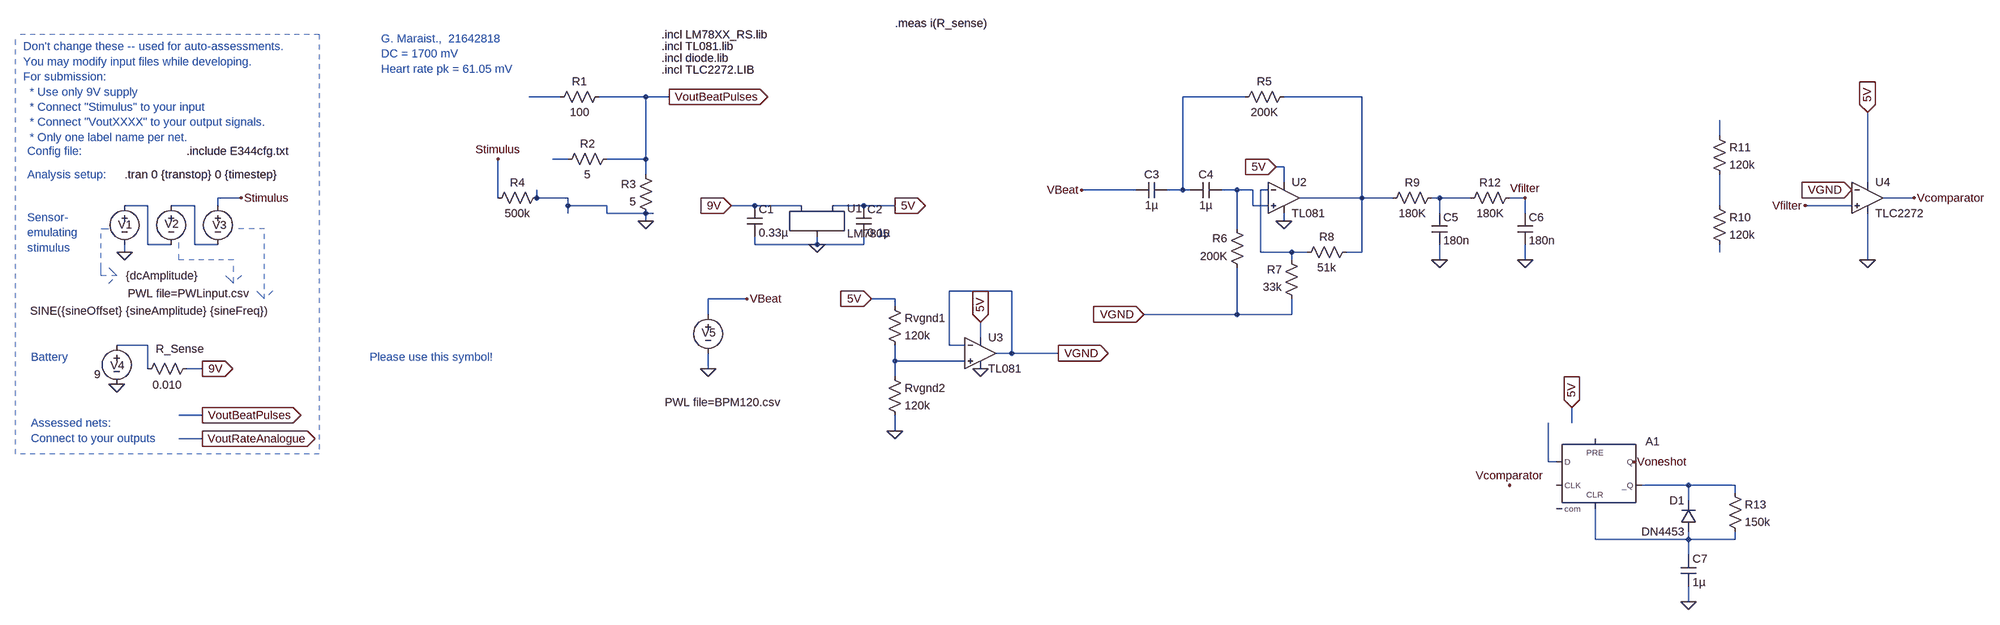
[diagram p0: schematic E344_Ass2_template.asc]
E344_Ass2_template.asc, the LTspice schematic file:
Version 4
SHEET 1 1824 680
WIRE -1184 -1280 -1248 -1280
WIRE -1008 -1280 -1104 -1280
WIRE -960 -1280 -1008 -1280
WIRE 224 -1280 96 -1280
WIRE 464 -1280 304 -1280
WIRE 1200 -1200 1200 -1232
WIRE -1168 -1152 -1200 -1152
WIRE -1008 -1152 -1008 -1280
WIRE -1008 -1152 -1088 -1152
WIRE 304 -1136 288 -1136
WIRE -1008 -1120 -1008 -1152
WIRE 304 -1104 304 -1136
WIRE 1504 -1104 1504 -1248
WIRE 0 -1088 -112 -1088
WIRE 96 -1088 96 -1280
WIRE 96 -1088 64 -1088
WIRE 112 -1088 96 -1088
WIRE 208 -1088 176 -1088
WIRE 240 -1088 208 -1088
WIRE 272 -1088 256 -1088
WIRE -1840 -1072 -1888 -1072
WIRE -1312 -1072 -1312 -1152
WIRE -1232 -1072 -1232 -1088
WIRE -1168 -1072 -1232 -1072
WIRE 464 -1072 464 -1280
WIRE 464 -1072 336 -1072
WIRE 528 -1072 464 -1072
WIRE 624 -1072 608 -1072
WIRE 688 -1072 624 -1072
WIRE 800 -1072 768 -1072
WIRE 1600 -1072 1536 -1072
WIRE -2032 -1056 -2080 -1056
WIRE -1936 -1056 -1984 -1056
WIRE -1888 -1056 -1888 -1072
WIRE -1168 -1056 -1168 -1072
WIRE -1088 -1056 -1168 -1056
WIRE -784 -1056 -832 -1056
WIRE -688 -1056 -784 -1056
WIRE -560 -1056 -624 -1056
WIRE -496 -1056 -560 -1056
WIRE 240 -1056 240 -1088
WIRE 272 -1056 240 -1056
WIRE 1200 -1056 1200 -1120
WIRE 1472 -1056 1376 -1056
WIRE -1168 -1040 -1168 -1056
WIRE -1088 -1040 -1088 -1056
WIRE -1008 -1040 -1088 -1040
WIRE -992 -1040 -1008 -1040
WIRE 624 -1040 624 -1072
WIRE 800 -1040 800 -1072
WIRE -1008 -1024 -1008 -1040
WIRE 304 -1024 304 -1040
WIRE 208 -1008 208 -1088
WIRE -2032 -976 -2032 -1056
WIRE -1984 -976 -2032 -976
WIRE -1936 -976 -1936 -1056
WIRE -1888 -976 -1936 -976
WIRE -784 -976 -784 -992
WIRE -656 -976 -656 -992
WIRE -656 -976 -784 -976
WIRE -560 -976 -560 -992
WIRE -560 -976 -656 -976
WIRE -2080 -960 -2080 -976
WIRE 256 -960 256 -1088
WIRE 320 -960 256 -960
WIRE 352 -960 320 -960
WIRE 464 -960 464 -1072
WIRE 464 -960 432 -960
WIRE 1200 -960 1200 -976
WIRE 320 -944 320 -960
WIRE 624 -944 624 -976
WIRE 800 -944 800 -976
WIRE 1504 -944 1504 -1040
WIRE -256 -880 -384 -880
WIRE -800 -864 -880 -864
WIRE -496 -864 -544 -864
WIRE -496 -848 -496 -864
WIRE -880 -832 -880 -864
WIRE 208 -832 208 -928
WIRE 208 -832 16 -832
WIRE 320 -832 320 -864
WIRE 320 -832 208 -832
WIRE -320 -784 -320 -816
WIRE -2032 -768 -2096 -768
WIRE -384 -768 -384 -880
WIRE -352 -768 -384 -768
WIRE -256 -752 -256 -880
WIRE -256 -752 -288 -752
WIRE -160 -752 -256 -752
WIRE -496 -736 -496 -768
WIRE -352 -736 -496 -736
WIRE -2032 -720 -2032 -768
WIRE -1920 -720 -1952 -720
WIRE -880 -720 -880 -752
WIRE -496 -704 -496 -736
WIRE -1920 -624 -1968 -624
WIRE 896 -608 896 -640
WIRE -496 -592 -496 -624
WIRE -1920 -576 -1968 -576
WIRE 848 -528 848 -608
WIRE 864 -528 848 -528
WIRE 1136 -480 1040 -480
WIRE 1232 -480 1136 -480
WIRE 1232 -464 1232 -480
WIRE 1136 -448 1136 -480
WIRE 944 -368 944 -432
WIRE 1136 -368 1136 -384
WIRE 1136 -368 944 -368
WIRE 1232 -368 1232 -384
WIRE 1232 -368 1136 -368
WIRE 1136 -336 1136 -368
WIRE 1136 -240 1136 -272
FLAG -2080 -960 0
FLAG -1840 -1072 Stimulus
FLAG -1920 -720 9V
IOPIN -1920 -720 Out
FLAG -2096 -688 0
FLAG -832 -1056 9V
IOPIN -832 -1056 In
FLAG -1920 -624 VoutBeatPulses
IOPIN -1920 -624 Out
FLAG -1312 -1152 Stimulus
FLAG -1008 -1024 0
FLAG -1920 -576 VoutRateAnalogue
IOPIN -1920 -576 Out
FLAG -960 -1280 VoutBeatPulses
IOPIN -960 -1280 Out
FLAG -656 -976 0
FLAG -496 -1056 5V
IOPIN -496 -1056 Out
FLAG -880 -720 0
FLAG -800 -864 VBeat
FLAG -160 -752 VGND
IOPIN -160 -752 Out
FLAG -496 -592 0
FLAG -544 -864 5V
IOPIN -544 -864 In
FLAG 304 -1024 0
FLAG 288 -1136 5V
IOPIN 288 -1136 In
FLAG 16 -832 VGND
IOPIN 16 -832 In
FLAG -112 -1088 VBeat
FLAG -320 -720 0
FLAG -320 -816 5V
IOPIN -320 -816 In
FLAG 624 -944 0
FLAG 1504 -1248 5V
IOPIN 1504 -1248 In
FLAG 1504 -944 0
FLAG 1600 -1072 Vcomparator
FLAG 1376 -1056 Vfilter
FLAG 800 -944 0
FLAG 800 -1072 Vfilter
FLAG 1136 -240 0
FLAG 1024 -528 Voneshot
FLAG 896 -640 5V
IOPIN 896 -640 In
FLAG 768 -480 Vcomparator
FLAG 1472 -1088 VGND
IOPIN 1472 -1088 In
SYMBOL voltage -1984 -1072 R0
WINDOW 123 0 0 Left 0
WINDOW 39 0 0 Left 0
WINDOW 3 -89 197 Left 2
WINDOW 0 -13 54 Left 2
SYMATTR Value PWL file=PWLinput.csv
SYMATTR InstName V2
SYMBOL voltage -1888 -1072 R0
WINDOW 123 24 44 Left 2
WINDOW 39 0 0 Left 0
WINDOW 3 -386 233 Left 2
WINDOW 0 -11 56 Left 2
SYMATTR Value SINE({sineOffset} {sineAmplitude} {sineFreq})
SYMATTR InstName V3
SYMBOL voltage -2080 -1072 R0
WINDOW 123 0 0 Left 0
WINDOW 39 0 0 Left 0
WINDOW 3 3 160 Left 2
WINDOW 0 -13 55 Left 2
SYMATTR Value {dcAmplitude}
SYMATTR InstName V1
SYMBOL voltage -2096 -784 R0
WINDOW 123 24 44 Left 2
WINDOW 39 0 0 Left 0
WINDOW 3 -46 76 Left 2
WINDOW 0 -13 57 Left 2
SYMATTR Value 9
SYMATTR InstName V4
SYMBOL res -1936 -736 R90
WINDOW 0 -9 30 VBottom 2
WINDOW 3 34 56 VTop 2
SYMATTR InstName R_Sense
SYMATTR Value 0.010
SYMBOL res -1200 -1264 R270
WINDOW 0 32 56 VTop 2
WINDOW 3 0 56 VBottom 2
SYMATTR InstName R1
SYMATTR Value 100
SYMBOL res -1072 -1168 R90
WINDOW 0 0 56 VBottom 2
WINDOW 3 32 56 VTop 2
SYMATTR InstName R2
SYMATTR Value 5
SYMBOL res -992 -1024 R180
WINDOW 0 36 76 Left 2
WINDOW 3 36 40 Left 2
SYMATTR InstName R3
SYMATTR Value 5
SYMBOL res -1216 -1088 R90
WINDOW 0 0 56 VBottom 2
WINDOW 3 32 56 VTop 2
SYMATTR InstName R4
SYMATTR Value 500k
SYMBOL LM7805 -656 -1040 R0
SYMATTR InstName U1
SYMBOL cap -800 -1056 R0
SYMATTR InstName C1
SYMATTR Value 0.33µ
SYMBOL cap -576 -1056 R0
SYMATTR InstName C2
SYMATTR Value 0.1µ
SYMBOL voltage -880 -848 R0
WINDOW 123 0 0 Left 0
WINDOW 39 0 0 Left 0
WINDOW 3 -89 197 Left 2
WINDOW 0 -13 54 Left 2
SYMATTR Value PWL file=BPM120.csv
SYMATTR InstName V5
SYMBOL res -512 -864 R0
SYMATTR InstName Rvgnd1
SYMATTR Value 120k
SYMBOL res -512 -720 R0
SYMATTR InstName Rvgnd2
SYMATTR Value 120k
SYMBOL cap 64 -1104 R90
WINDOW 0 0 32 VBottom 2
WINDOW 3 32 32 VTop 2
SYMATTR InstName C3
SYMATTR Value 1µ
SYMBOL cap 176 -1104 R90
WINDOW 0 0 32 VBottom 2
WINDOW 3 32 32 VTop 2
SYMATTR InstName C4
SYMATTR Value 1µ
SYMBOL res 320 -1296 R90
WINDOW 0 0 56 VBottom 2
WINDOW 3 32 56 VTop 2
SYMATTR InstName R5
SYMATTR Value 200K
SYMBOL res 224 -912 R180
WINDOW 0 36 76 Left 2
WINDOW 3 36 40 Left 2
SYMATTR InstName R6
SYMATTR Value 200K
SYMBOL res 336 -848 R180
WINDOW 0 36 76 Left 2
WINDOW 3 36 40 Left 2
SYMATTR InstName R7
SYMATTR Value 33k
SYMBOL res 448 -976 R90
WINDOW 0 0 56 VBottom 2
WINDOW 3 32 56 VTop 2
SYMATTR InstName R8
SYMATTR Value 51k
SYMBOL Opamps\\opamp2 304 -1136 R0
SYMATTR InstName U2
SYMATTR Value TL081
SYMBOL Opamps\\opamp2 -320 -816 R0
SYMATTR InstName U3
SYMATTR Value TL081
SYMBOL res 624 -1088 R90
WINDOW 0 0 56 VBottom 2
WINDOW 3 32 56 VTop 2
SYMATTR InstName R9
SYMATTR Value 180K
SYMBOL cap 608 -1040 R0
SYMATTR InstName C5
SYMATTR Value 180n
SYMBOL Opamps\\opamp2 1504 -1136 R0
SYMATTR InstName U4
SYMATTR Value TLC2272
SYMBOL res 1184 -1072 R0
SYMATTR InstName R10
SYMATTR Value 120k
SYMBOL res 1184 -1216 R0
SYMATTR InstName R11
SYMATTR Value 120k
SYMBOL cap 784 -1040 R0
SYMATTR InstName C6
SYMATTR Value 180n
SYMBOL res 784 -1088 R90
WINDOW 0 0 56 VBottom 2
WINDOW 3 32 56 VTop 2
SYMATTR InstName R12
SYMATTR Value 180K
SYMBOL res 1216 -480 R0
SYMATTR InstName R13
SYMATTR Value 150k
SYMBOL cap 1120 -336 R0
SYMATTR InstName C7
SYMATTR Value 1µ
SYMBOL diode 1152 -384 R180
WINDOW 0 24 64 Left 2
WINDOW 3 24 0 Left 2
SYMATTR InstName D1
SYMATTR Value DN4453
SYMBOL Digital\\dflop 944 -576 R0
WINDOW 3 0 0 Invisible 0
SYMATTR InstName A1
SYMATTR Value Vhigh=5 Vlow=0
TEXT -2080 -1120 Left 2 !.tran 0 {transtop} 0 {timestep}
TEXT -1952 -1168 Left 2 !.include E344cfg.txt
TEXT -2288 -1384 Left 2 ;Don't change these -- used for auto-assessments.\nYou may modify input files while developing.\nFor submission: \n  * Use only 9V supply \n  * Connect "Stimulus" to your input\n  * Connect "VoutXXXX" to your output signals.\n  * Only one label name per net.
TEXT -2280 -1168 Left 2 ;Config file:
TEXT -2280 -1120 Left 2 ;Analysis setup:
TEXT -2272 -744 Left 2 ;Battery
TEXT -2280 -1032 Left 2 ;Sensor-\nemulating \nstimulus
TEXT -2272 -608 Left 2 ;Assessed nets:\nConnect to your outputs
TEXT -1552 -1400 Left 2 ;G. Maraist.,  21642818\nDC = 1700 mV\nHeart rate pk = 61.05 mV
TEXT -1576 -744 Left 2 ;Please use this symbol!
TEXT -976 -1408 Left 2 !.incl LM78XX_RS.lib
TEXT -976 -1384 Left 2 !.incl TL081.lib
TEXT -976 -1360 Left 2 !.incl diode.lib
TEXT -976 -1336 Left 2 !.incl TLC2272.LIB
TEXT -496 -1432 Left 2 !.meas i(R_sense)
LINE Normal -1792 -1008 -1856 -1008 2
LINE Normal -1792 -864 -1792 -1008 2
LINE Normal -1808 -880 -1792 -864 2
LINE Normal -1792 -864 -1808 -880 2
LINE Normal -1776 -880 -1792 -864 2
LINE Normal -2128 -1008 -2112 -1008 2
LINE Normal -2128 -928 -2128 -1008 2
LINE Normal -2128 -912 -2128 -928 2
LINE Normal -2096 -912 -2128 -912 2
LINE Normal -2112 -928 -2096 -912 2
LINE Normal -2096 -912 -2112 -928 2
LINE Normal -2112 -896 -2096 -912 2
LINE Normal -1968 -944 -1968 -992 2
LINE Normal -1856 -944 -1968 -944 2
LINE Normal -1856 -896 -1856 -944 2
LINE Normal -1872 -912 -1856 -896 2
LINE Normal -1856 -896 -1872 -912 2
LINE Normal -1840 -912 -1856 -896 2
LINE Normal -2304 -544 -2304 -1408 1
LINE Normal -1680 -1408 -1680 -544 1
LINE Normal -1680 -544 -2304 -544 1
LINE Normal -1680 -1408 -2304 -1408 1

The netlist it stands for:
* E344_Ass2_template.asc
V2 N010 N009 PWL file=PWLinput.csv
V3 Stimulus N010 SINE({sineOffset} {sineAmplitude} {sineFreq})
V1 N009 0 {dcAmplitude}
V4 N013 0 9
R_Sense 9V N013 0.010
R1 N001 VoutBeatPulses 100
R2 VoutBeatPulses N005 5
R3 0 VoutBeatPulses 5
R4 0 Stimulus 500k
XU1 9V 0 5V LM7805
C1 9V 0 0.33µ
C2 5V 0 0.1µ
V5 VBeat 0 PWL file=BPM120.csv
Rvgnd1 5V N014 120k
Rvgnd2 N014 0 120k
C3 N002 VBeat 1µ
C4 N006 N002 1µ
R5 N003 N002 200K
R6 VGND N006 200K
R7 VGND N007 33k
R8 N003 N007 51k
XU2 N006 N007 5V 0 N003 TL081  ; pins In+ In- V+ V- OUT
XU3 N014 VGND 5V 0 VGND TL081  ; pins In+ In- V+ V- OUT
R9 N008 N003 180K
C5 N008 0 180n
XU4 Vfilter VGND 5V 0 Vcomparator TLC2272  ; pins In+ In- V+ V- OUT
R10 N011 N012 120k
R11 N004 N011 120k
C6 Vfilter 0 180n
R12 Vfilter N008 180K
R13 N016 N017 150k
C7 N017 0 1µ
D1 N017 N016 DN4453
A1 N015 0 0 0 N017 N016 Voneshot 0 DFLOP Vhigh=5 Vlow=0
.model D D
.lib standard.dio
.tran 0 {transtop} 0 {timestep}
.include E344cfg.txt
* Don't change these -- used for auto-assessments.
* You may modify input files while developing.
* For submission:
*   * Use only 9V supply
*   * Connect "Stimulus" to your input
*   * Connect "VoutXXXX" to your output signals.
*   * Only one label name per net.
* Config file:
* Analysis setup:
* Battery
* Sensor-
* emulating
* stimulus
* Assessed nets:
* Connect to your outputs
* G. Maraist.,  21642818
* DC = 1700 mV
* Heart rate pk = 61.05 mV
* Please use this symbol!
.incl LM78XX_RS.lib
.incl TL081.lib
.incl diode.lib
.incl TLC2272.LIB
.meas i(R_sense)
.backanno
.end